# Altium schematic sheet POWER_NODE.SchDoc
size A
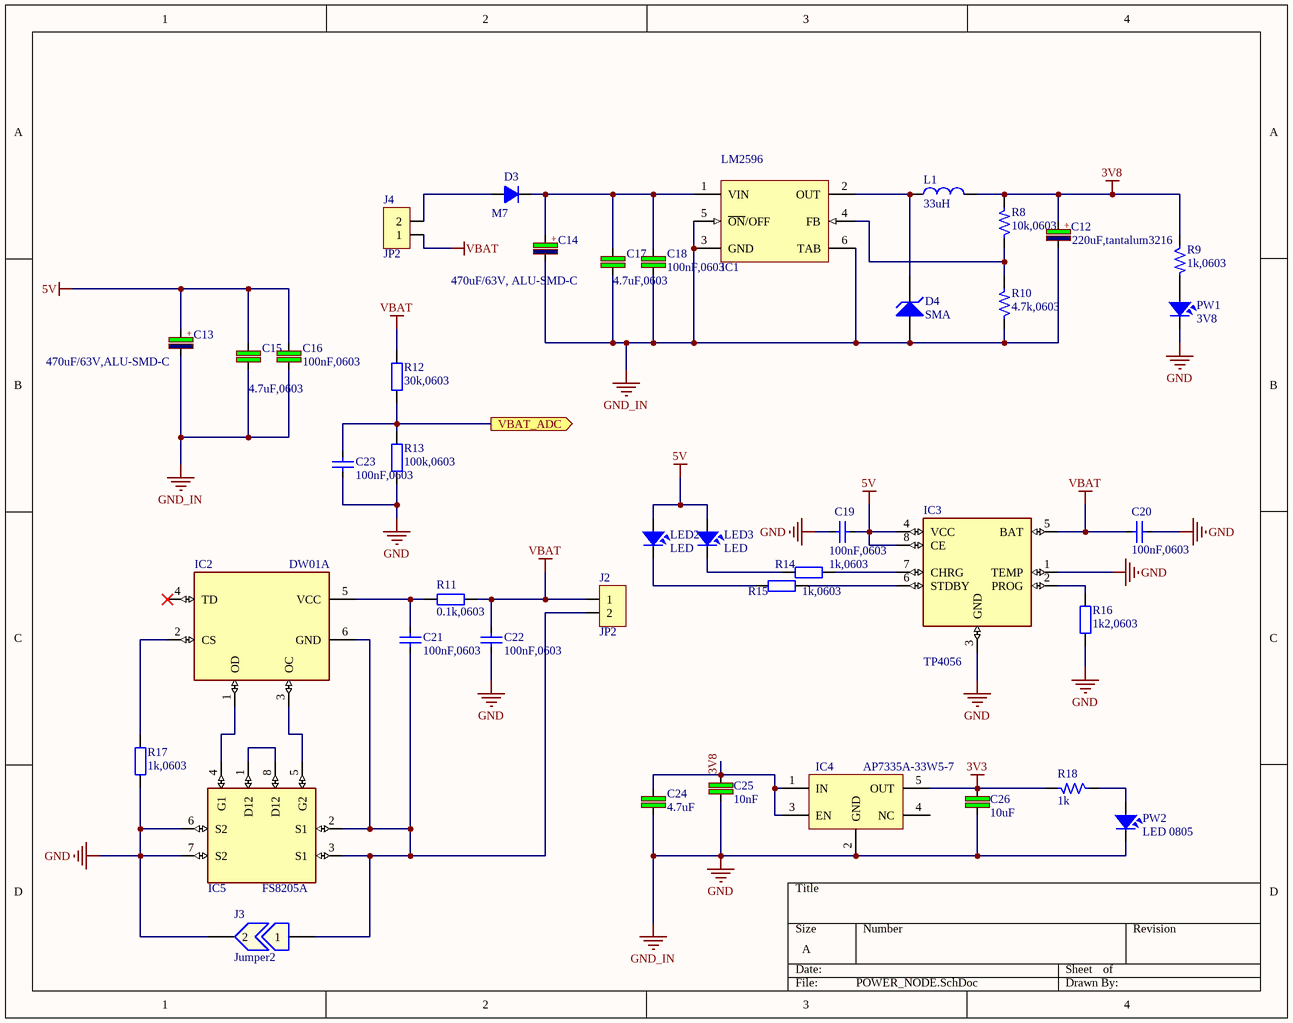
[diagram p0: POWER_NODE.SchDoc]

## Parts
C12  value 220uF,tantalum3216  [CAP_TANTALUM_3216]  (hidden comment: 220uF)
C13  470uF/63V,ALU-SMD-C  [CAP-ALU-SMD-C]
C14  470uF/63V, ALU-SMD-C  [CAP-ALU-SMD-C]
C15  value 4.7uF,0603  [CAP_0603]  (hidden comment: 4.7uF)
C16  value 100nF,0603  [CAP_0603]  (hidden comment: 4.7uF)
C17  value 4.7uF,0603  [CAP_0603]  (hidden comment: 4.7uF)
C18  value 100nF,0603  [CAP_0603]  (hidden comment: 4.7uF)
C19  100nF,0603  [CAP_0603]
C20  100nF,0603  [CAP_0603]
C21  100nF,0603  [CAP_0603]
C22  100nF,0603  [CAP_0603]
C23  100nF,0603  [CAP_0603]
C24  4.7uF  [CAP_0603]
C25  10nF  [CAP_0603]
C26  10uF  [CAP_0603]
D3  M7  [SMA]
D4  SMA  [SMA]
IC1  LM2596  [TO-263]
IC2  DW01A  [SOT23-6]
IC3  TP4056  [TP4056]
IC4  AP7335A-33W5-7  [SOT23-5]
IC5  FS8205A  [FS8205A]
J2  JP2  [KF2-5.08]
J3  Jumper2  [JUMPER2]
J4  JP2  [KF2-5.08]
L1  33uH  [Inductor_SMD]
LED2  LED  [LED-0805-Blue]
LED3  LED  [LED-0805-Blue]
PW1  3V8  [LED-0805-Blue]
PW2  LED 0805  [LED-0805-Blue]
R8  10k,0603  [RES-SMD-0603]
R9  1k,0603  [RES-SMD-0603]
R10  4.7k,0603  [RES-SMD-0603]
R11  0.1k,0603  [RES-SMD-0603]
R12  30k,0603  [RES-SMD-0603]
R13  100k,0603  [RES-SMD-0603]
R14  1k,0603  [RES-SMD-0603]
R15  1k,0603  [RES-SMD-0603]
R16  1k2,0603  [RES-SMD-0603]
R17  1k,0603  [RES-SMD-0603]
R18  1k  [RES-SMD-0603]

## Ports
VBAT_ADC (out)

## Nets
3V3: C26.1 IC4.5(OUT) R18.2
3V8: C12.1 C24.2 C25.1 IC4.1(IN) IC4.3(EN) L1.2 R8.2 R9.1
5V: C13.1 C15.2 C16.2 C19.1 IC3.4(VCC) IC3.8(CE) LED2.1 LED3.1
GND: C12.2 C13.2 C14.2 C15.1 C16.1 C17.1 C18.1 C19.2 C20.1 C22.1 C23.1 C24.1 C25.2 C26.2 D4.1(A) IC1.3(GND) IC1.5(~{ON}/OFF) IC1.6(TAB) IC3.1(TEMP) IC3.3(GND) IC4.2(GND) IC5.6(S2) IC5.7(S2) J3.2 PW1.2 PW2.2 R10.1 R13.1 R16.2 R17.2  [also labelled GND_IN]
VBAT: C20.2 C22.2 IC3.5(BAT) J2.1 J4.1 R11.2 R12.2
VBAT_ADC: C23.2 R12.1 R13.2 ; port VBAT_ADC
NetC14_1: C14.1 C17.2 C18.2 D3.2(K) IC1.1(VIN)
NetC21_1: C21.1 IC2.6(GND) IC5.2(S1) IC5.3(S1) J2.2 J3.1
NetC21_2: C21.2 IC2.5(VCC) R11.1
NetD3_1: D3.1(A) J4.2
NetD4_2: D4.2(K) IC1.2(OUT) L1.1
NetIC1_4: IC1.4(FB) R8.1 R10.2
NetIC2_1: IC2.1(OD) IC5.4(G1)
NetIC2_2: IC2.2(CS) R17.1
NetIC2_3: IC2.3(OC) IC5.5(G2)
NetIC3_2: IC3.2(PROG) R16.1
NetIC3_6: IC3.6(STDBY) R15.2
NetIC3_7: IC3.7(CHRG) R14.2
NetIC5_1: IC5.1(D12) IC5.8(D12)
NetLED2_2: LED2.2 R15.1
NetLED3_2: LED3.2 R14.1
NetPW1_1: PW1.1 R9.2
NetPW2_1: PW2.1 R18.1

Not connected (* = marked no-connect by the designer): IC2 4(TD)*; IC4 4(NC)

## Notes on the sheet
- (in symbol CP3) +
- (in symbol CP5) +

## Library data of the parts
C12 = CP5: 220µF Molded Tantalum Polymer Capacitor 16V 2917 (7343 Metric) 40mOhm @ 100kHz; Manufacturer: AVX Corporation; Part number: TCME227M016R0040E; User_Description: CAP TANT POLY 220UF 16V 2917; Category: CAPACITOR; Package: 2917
C13 C14 = CP3: Cap 470uF/63V; Value: Cap 470uF/63V
C15-C18 C24 = C: 4.7µF ±10% 35V Ceramic Capacitor X5R 0805 (2012 Metric); Manufacturer: Samsung Electro-Mechanics; Part number: CL21A475KLCLQNC; User_Description: CAP CER 4.7UF 35V X5R 0805; Category: CAPACITOR; Package: 0805
  C24: Value: 4.7uF
C19-C23 = CapSMD: Capacitor; Value: 33p; Published: 8-Jun-2000; LatestRevisionDate: 17-Jul-2002; LatestRevisionNote: Re-released for DXP Platform.; PackageReference: RAD-0.3; Publisher: Altium Limited
C25 = C: Cap SMD; Manufacturer: Samsung Electro-Mechanics; Part number: CL21A106KPFNNNG; Value: 10uF; User_Description: CAP CER 10UF 10V X5R 0805; Category: CAPACITOR; Package: 0805
C26 = C: Cap SMD; Manufacturer: Samsung Electro-Mechanics; Part number: CL21A106KPFNNNG; User_Description: CAP CER 10UF 10V X5R 0805; Value: 10uF; Category: CAPACITOR; Package: 0805
D3 = D1A: Diode 1A; Value: 1N4007
D4 = Diode Zener: Zener Diode; Published: 8-Jun-2000; LatestRevisionDate: 17-Jul-2002; LatestRevisionNote: Re-released for DXP Platform.; PackageReference: DIODE-0.7; Publisher: Altium Limited
IC1 = LM2576
IC2 = DW01A: One Cell Lithium-ion/Polymer Battery Protection IC
IC3 = TP4056: Complete single cell Li-Ion battery with a constant current / constant voltage linear charger
J2 J4 = JP2: WR-PHD 2.54 mm Angled Socket Header; Manufacturer: W¨¹rth Elektronik eiSos GmbH; partNo: 613002143121; ComponentLink1 Description: Manufacturer; ComponentLink2 Description: Datasheet; NoPins: 02; Created Date: 29 March 2013; ComponentLink1URL: http://www.we-online.com; ComponentLink2URL: http://katalog.we-online.de/em/datasheet/6130xx143121.pdf; Created by: Karrer Zheng
J3 = Jumper2: Jumper, 2-Pin
L1 = L1: 22µH Shielded Inductor 1.65A 96mOhm Max Nonstandard; Manufacturer: Bourns Inc.; Part Number: SRR0745A-220M; Value: 220uH; User_Description: FIXED IND 22UH 1.65A 96 MOHM SMD; Category: INDUCTORS; Package: SMD
LED2 LED3 = LED: LED Single colour Green and Red; Value: LED 3 ly Single Colour
PW1 PW2 = LED: LED RED DIFFUSED 0805 SMD; Manufacturer: OSRAM Opto Semiconductors Inc.; Part number: LS R976-NR-1; Value: Red; Category: LED SMD; Package: 0805; User_Description: LED RED DIFFUSED 0805 SMD
R8 = R: RES SMD 10K OHM 1% 1/8W 0805; Manufacturer: Yageo; Part number: RC0805FR-0710KL; Category: RESISTORS; Package: 0805; User_Description: RES SMD 10K OHM 1% 1/8W 0805; Value: 10k
R9 R18 = R: Resistor 1/4W; Manufacturer: Yageo; Part number: RC0805FR-071KL; User_Description: RES SMD 1K OHM 1% 1/8W 0805; Value: 1k; Category: RESISTORS; Package: 0805
R10 = R: RES SMD 3.3K OHM 1% 1/8W 0805; Manufacturer: Yageo; Part number: RC0805FR-073K3L; Category: RESISTORS; Package: 0805; User_Description: RES SMD 3.3K OHM 1% 1/8W 0805; Value: 3.3k
R11-R17 = Resistor - SMD: Resistor SMD; Manufacturer: Generic Components; Class: Passive; Published: 08/06/2000; Publisher: Altium Hobart Technology Centre
IC4 = AP7335A-33W5-7: Package: SOT23-5; Part number: AP7335A-33W5-7